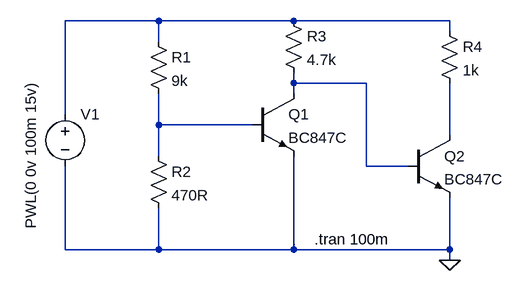
[diagram p0: schematic npn.asc]
npn.asc, the LTspice schematic file:
Version 4
SHEET 1 880 680
WIRE -224 32 -368 32
WIRE -16 32 -224 32
WIRE 224 32 -16 32
WIRE 224 48 224 32
WIRE -224 64 -224 32
WIRE -16 128 -16 112
WIRE 96 128 -16 128
WIRE -16 144 -16 128
WIRE -368 176 -368 32
WIRE -224 192 -224 144
WIRE -80 192 -224 192
WIRE 224 208 224 128
WIRE -224 240 -224 192
WIRE 96 256 96 128
WIRE 160 256 96 256
WIRE -368 384 -368 256
WIRE -224 384 -224 320
WIRE -224 384 -368 384
WIRE -16 384 -16 240
WIRE -16 384 -224 384
WIRE 224 384 224 304
WIRE 224 384 -16 384
WIRE 224 400 224 384
FLAG 224 400 0
SYMBOL voltage -368 160 R0
WINDOW 3 -53 192 VLeft 2
WINDOW 123 0 0 Left 0
WINDOW 39 0 0 Left 0
SYMATTR InstName V1
SYMATTR Value PWL(0 0v 100m 15v)
SYMBOL res -240 48 R0
SYMATTR InstName R1
SYMATTR Value 9k
SYMBOL res -240 224 R0
SYMATTR InstName R2
SYMATTR Value 470R
SYMBOL npn -80 144 R0
SYMATTR InstName Q1
SYMATTR Value BC847C
SYMBOL npn 160 208 R0
SYMATTR InstName Q2
SYMATTR Value BC847C
SYMBOL res -32 16 R0
SYMATTR InstName R3
SYMATTR Value 4.7k
SYMBOL res 208 32 R0
SYMATTR InstName R4
SYMATTR Value 1k
TEXT 16 368 Left 2 !.tran 100m

The netlist it stands for:
* npn.asc
V1 N001 0 PWL(0 0v 100m 15v)
R1 N001 N003 9k
R2 N003 0 470R
Q1 N002 N003 0 0 BC847C
Q2 N004 N002 0 0 BC847C
R3 N001 N002 4.7k
R4 N001 N004 1k
.model NPN NPN
.model PNP PNP
.lib standard.bjt
.tran 100m
.backanno
.end